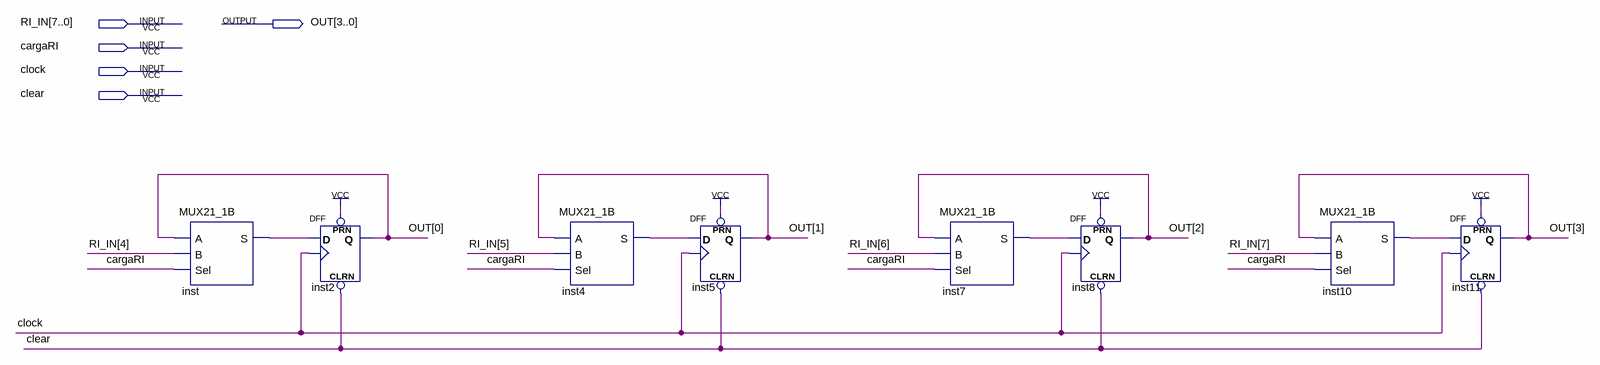
[diagram p0: schematic sheet]
// Quartus schematic RI_opcode.bdf as structural Verilog: 8 symbols, 5 pins
module RI_opcode (
  input  [7:0] RI_IN,
  input  cargaRI,
  input  clock,
  input  clear,
  output [3:0] OUT
);

  wire inst4_s, inst7_s, inst10_s, inst_s;

  MUX21_1B inst (.A(OUT[0]), .B(RI_IN[4]), .Sel(cargaRI), .S(inst_s));
  DFF inst2 (.CLRN(clear), .CLK(clock), .D(inst_s), .PRN(1'b1), .Q(OUT[0]));
  MUX21_1B inst4 (.A(OUT[1]), .B(RI_IN[5]), .Sel(cargaRI), .S(inst4_s));
  DFF inst5 (.CLRN(clear), .CLK(clock), .D(inst4_s), .PRN(1'b1), .Q(OUT[1]));
  MUX21_1B inst7 (.A(OUT[2]), .B(RI_IN[6]), .Sel(cargaRI), .S(inst7_s));
  DFF inst8 (.CLRN(clear), .CLK(clock), .D(inst7_s), .PRN(1'b1), .Q(OUT[2]));
  MUX21_1B inst10 (.A(OUT[3]), .B(RI_IN[7]), .Sel(cargaRI), .S(inst10_s));
  DFF inst11 (.CLRN(clear), .CLK(clock), .D(inst10_s), .PRN(1'b1), .Q(OUT[3]));
endmodule
